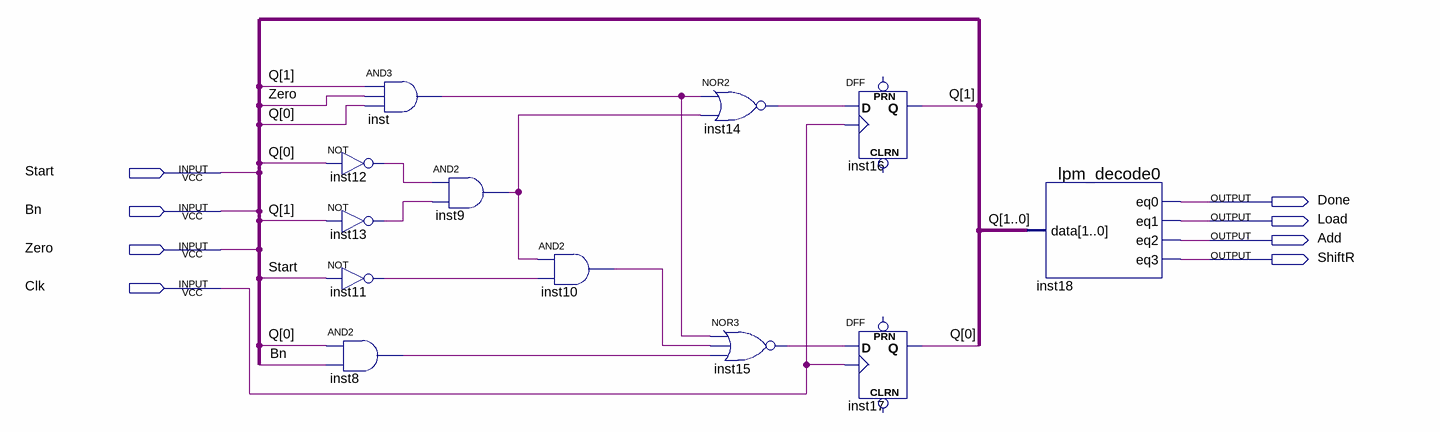
[diagram p0: schematic sheet]
// Quartus schematic UA2.bdf as structural Verilog: 12 symbols, 8 pins
module UA2 (
  input  Start,
  input  Bn,
  input  Zero,
  input  Clk,
  output Done,
  output Load,
  output Add,
  output ShiftR
);

  wire inst8_out, inst9_out, inst10_out, inst11_out, inst12_out, inst13_out, inst14_out, inst15_out, inst_out;
  wire [1:0] Q;

  not inst12 (inst12_out, Q[0]);
  not inst13 (inst13_out, Q[1]);
  not inst11 (inst11_out, Start);
  and inst8 (inst8_out, Q[0], Bn);
  and inst (inst_out, Q[1], Zero, Q[0]);
  and inst9 (inst9_out, inst12_out, inst13_out);
  and inst10 (inst10_out, inst9_out, inst11_out);
  nor inst14 (inst14_out, inst_out, inst9_out);
  nor inst15 (inst15_out, inst_out, inst10_out, inst8_out);
  DFF inst16 (.CLK(Clk), .D(inst14_out), .Q(Q[1]));  // open: CLRN, PRN
  DFF inst17 (.CLK(Clk), .D(inst15_out), .Q(Q[0]));  // open: CLRN, PRN
  lpm_decode0 inst18 (.data(Q), .eq0(Done), .eq1(Load), .eq2(Add), .eq3(ShiftR));
endmodule
